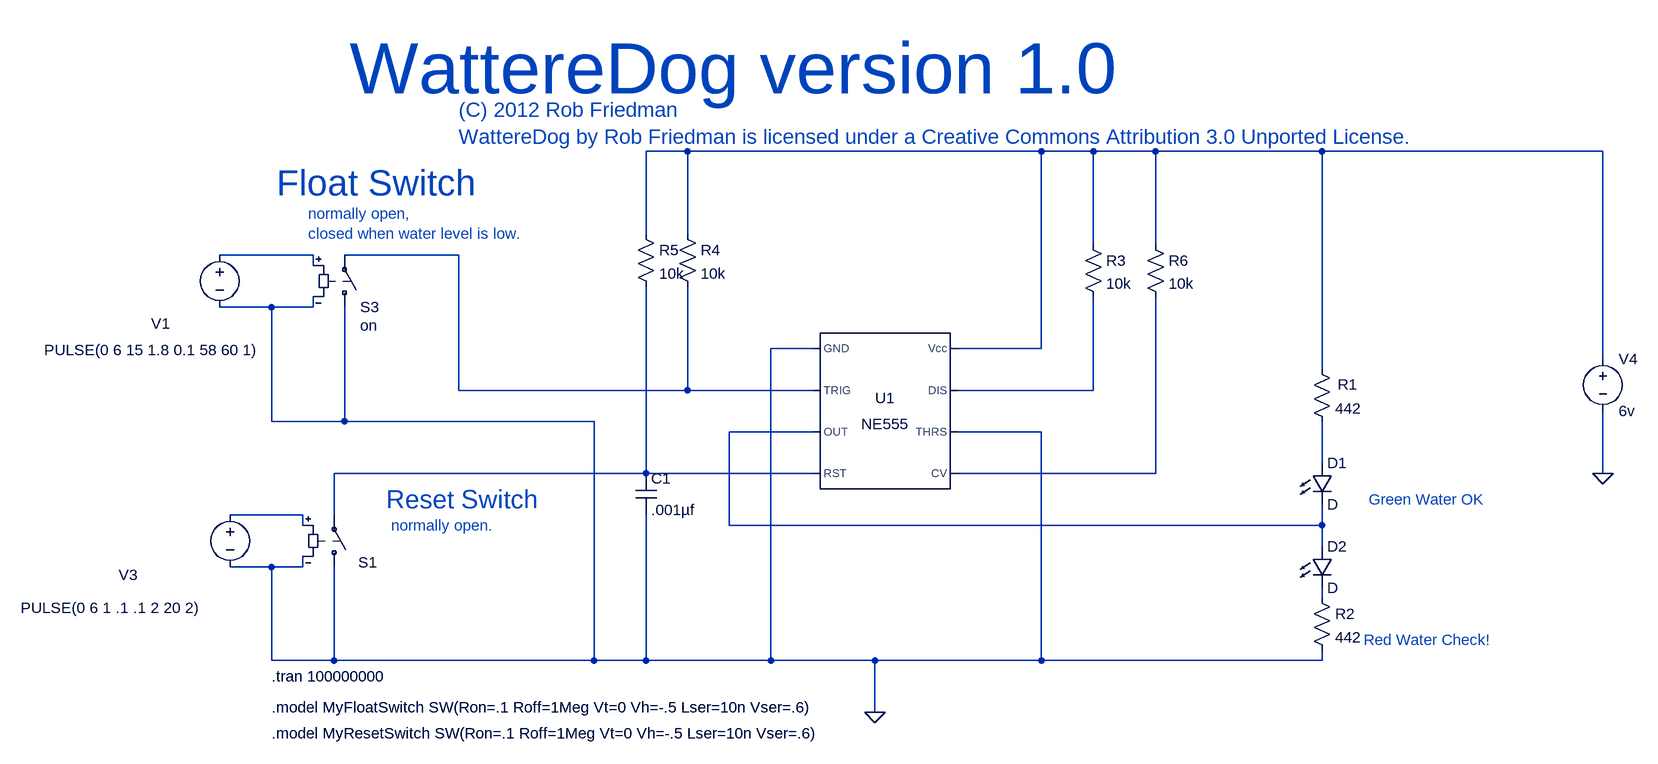
[diagram p0: schematic 5551.asc]
5551.asc, the LTspice schematic file:
Version 4
SHEET 1 1676 680
WIRE -176 -1040 -240 -1040
WIRE 368 -1040 -176 -1040
WIRE 448 -1040 368 -1040
WIRE 544 -1040 448 -1040
WIRE 800 -1040 544 -1040
WIRE 1232 -1040 800 -1040
WIRE -240 -912 -240 -1040
WIRE -176 -912 -176 -1040
WIRE 448 -896 448 -1040
WIRE 544 -896 544 -1040
WIRE -752 -880 -896 -880
WIRE -528 -880 -704 -880
WIRE -752 -864 -752 -880
WIRE -816 -800 -896 -800
WIRE -752 -800 -752 -816
WIRE -752 -800 -816 -800
WIRE 16 -736 -48 -736
WIRE 368 -736 368 -1040
WIRE 368 -736 240 -736
WIRE 1232 -720 1232 -1040
WIRE 800 -704 800 -1040
WIRE -528 -672 -528 -880
WIRE -176 -672 -176 -832
WIRE -176 -672 -528 -672
WIRE 16 -672 -176 -672
WIRE 448 -672 448 -816
WIRE 448 -672 240 -672
WIRE -816 -624 -816 -800
WIRE -704 -624 -704 -800
WIRE -704 -624 -816 -624
WIRE -320 -624 -704 -624
WIRE 16 -608 -112 -608
WIRE 368 -608 240 -608
WIRE 800 -560 800 -624
WIRE -240 -544 -240 -832
WIRE -240 -544 -720 -544
WIRE 16 -544 -240 -544
WIRE 544 -544 544 -816
WIRE 544 -544 240 -544
WIRE 1232 -544 1232 -640
WIRE -768 -480 -880 -480
WIRE -720 -480 -720 -544
WIRE -768 -464 -768 -480
WIRE -112 -464 -112 -608
WIRE 800 -464 800 -496
WIRE 800 -464 -112 -464
WIRE 800 -432 800 -464
WIRE -816 -400 -880 -400
WIRE -768 -400 -768 -416
WIRE -768 -400 -816 -400
WIRE 800 -352 800 -368
WIRE -816 -256 -816 -400
WIRE -720 -256 -720 -400
WIRE -720 -256 -816 -256
WIRE -320 -256 -320 -624
WIRE -320 -256 -720 -256
WIRE -240 -256 -240 -480
WIRE -240 -256 -320 -256
WIRE -48 -256 -48 -736
WIRE -48 -256 -240 -256
WIRE 112 -256 -48 -256
WIRE 368 -256 368 -608
WIRE 368 -256 112 -256
WIRE 800 -256 800 -272
WIRE 800 -256 368 -256
WIRE 112 -176 112 -256
FLAG 112 -176 0
FLAG 1232 -544 0
SYMBOL Misc\\NE555 128 -640 R0
SYMATTR InstName U1
SYMBOL LED 784 -560 R0
SYMATTR InstName D1
SYMBOL res 784 -720 R0
WINDOW 0 40 39 Left 2
SYMATTR InstName R1
SYMATTR Value 442
SYMATTR SpiceLine tol=1 pwr=0.1
SYMBOL res 784 -368 R0
SYMATTR InstName R2
SYMATTR Value 442
SYMATTR SpiceLine pwr=0.25
SYMBOL res -192 -928 R0
SYMATTR InstName R4
SYMATTR Value 10k
SYMBOL res -256 -928 R0
SYMATTR InstName R5
SYMATTR Value 10k
SYMBOL cap -256 -544 R0
SYMATTR InstName C1
SYMATTR Value .001µf
SYMBOL sw -704 -784 M180
WINDOW 3 24 -12 Left 2
SYMATTR Value on
SYMATTR InstName S3
SYMATTR SpiceModel MyFloatSwitch
SYMBOL sw -720 -384 M180
WINDOW 0 37 23 Left 2
SYMATTR InstName S1
SYMATTR Value ""
SYMATTR SpiceModel MyResetSwitch
SYMBOL voltage -896 -896 R0
WINDOW 0 -105 121 Left 2
WINDOW 3 -270 162 Left 2
WINDOW 123 0 0 Left 2
WINDOW 39 0 0 Left 2
SYMATTR InstName V1
SYMATTR Value PULSE(0 6 15 1.8 0.1 58 60 1)
SYMBOL voltage -880 -496 R0
WINDOW 0 -171 108 Left 2
WINDOW 3 -322 159 Left 2
WINDOW 123 0 0 Left 2
WINDOW 39 0 0 Left 2
SYMATTR InstName V3
SYMATTR Value PULSE(0 6 1 .1 .1 2 20 2)
SYMBOL voltage 1232 -736 R0
WINDOW 123 0 0 Left 2
WINDOW 39 0 0 Left 2
SYMATTR InstName V4
SYMATTR Value 6v
SYMBOL res 432 -912 R0
SYMATTR InstName R3
SYMATTR Value 10k
SYMBOL res 528 -912 R0
SYMATTR InstName R6
SYMATTR Value 10k
SYMBOL LED 784 -432 R0
SYMATTR InstName D2
TEXT -808 -992 Left 5 ;Float Switch
TEXT -816 -232 Left 2 !.tran 100000000
TEXT -760 -944 Left 2 ;normally open, \nclosed when water level is low.
TEXT -640 -504 Left 4 ;Reset Switch
TEXT -632 -464 Left 2 ;normally open.
TEXT 872 -504 Left 2 ;Green Water OK
TEXT 864 -288 Left 2 ;Red Water Check!
TEXT -816 -184 Left 2 !.model MyFloatSwitch SW(Ron=.1 Roff=1Meg Vt=0 Vh=-.5 Lser=10n Vser=.6)
TEXT -816 -144 Left 2 !.model MyResetSwitch SW(Ron=.1 Roff=1Meg Vt=0 Vh=-.5 Lser=10n Vser=.6)
TEXT -696 -1168 Left 7 ;WattereDog version 1.0
TEXT -528 -1104 Left 3 ;(C) 2012 Rob Friedman\nWattereDog by Rob Friedman is licensed under a Creative Commons Attribution 3.0 Unported License.

The netlist it stands for:
* 5551.asc
XU1 0 N003 N005 N007 N008 0 N004 N001 NE555  ; pins GND TRIG OUT RST CV THRS DIS Vcc
D1 N006 N005 D
R1 N001 N006 442 tol=1 pwr=0.1
R2 N010 0 442 pwr=0.25
R4 N001 N003 10k
R5 N001 N007 10k
C1 N007 0 .001µf
S3 0 N003 N002 0 MyFloatSwitch on
S1 0 N007 N009 0 MyResetSwitch
V1 N002 0 PULSE(0 6 15 1.8 0.1 58 60 1)
V3 N009 0 PULSE(0 6 1 .1 .1 2 20 2)
V4 N001 0 6v
R3 N001 N004 10k
R6 N001 N008 10k
D2 N005 N010 D
.model D D
.lib standard.dio
* Float Switch
.tran 100000000
* normally open,
* closed when water level is low.
* Reset Switch
* normally open.
* Green Water OK
* Red Water Check!
.model MyFloatSwitch SW(Ron=.1 Roff=1Meg Vt=0 Vh=-.5 Lser=10n Vser=.6)
.model MyResetSwitch SW(Ron=.1 Roff=1Meg Vt=0 Vh=-.5 Lser=10n Vser=.6)
* WattereDog version 1.0
* (C) 2012 Rob Friedman
* WattereDog by Rob Friedman is licensed under a Creative Commons Attribution 3.0 Unported License.
.lib NE555.sub
.backanno
.end